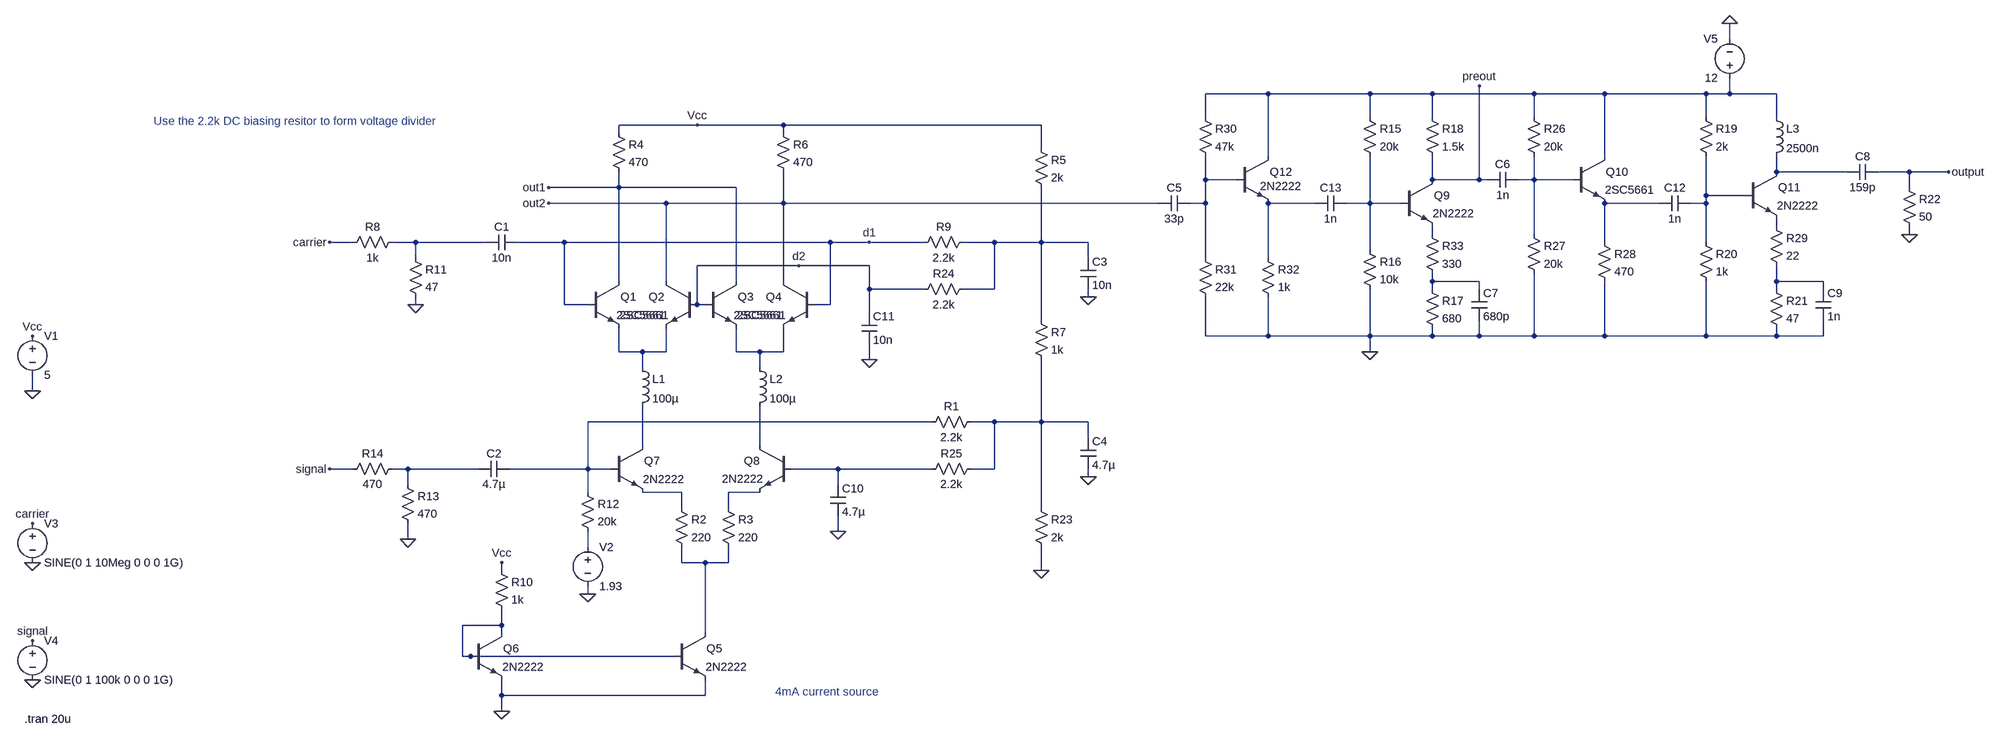
[diagram p0: schematic 100MHz_gilbert_cell.asc]
100MHz_gilbert_cell.asc, the LTspice schematic file:
Version 4
SHEET 1 2944 1096
WIRE 2400 -384 2400 -416
WIRE 1456 -272 1328 -272
WIRE 1664 -272 1456 -272
WIRE 1792 -272 1664 -272
WIRE 2000 -272 1792 -272
WIRE 2144 -272 2000 -272
WIRE 2352 -272 2144 -272
WIRE 2400 -272 2400 -304
WIRE 2400 -272 2352 -272
WIRE 2496 -272 2400 -272
WIRE 1328 -224 1328 -272
WIRE 1664 -224 1664 -272
WIRE 1792 -224 1792 -272
WIRE 2000 -224 2000 -272
WIRE 2352 -224 2352 -272
WIRE 2496 -224 2496 -272
WIRE 288 -208 128 -208
WIRE 464 -208 288 -208
WIRE 992 -208 464 -208
WIRE 128 -192 128 -208
WIRE 464 -192 464 -208
WIRE 992 -160 992 -208
WIRE 1456 -144 1456 -272
WIRE 2144 -144 2144 -272
WIRE 2496 -112 2496 -144
WIRE 2640 -112 2496 -112
WIRE 2768 -112 2704 -112
WIRE 2848 -112 2768 -112
WIRE 1328 -96 1328 -144
WIRE 1392 -96 1328 -96
WIRE 1792 -96 1792 -144
WIRE 1888 -96 1888 -288
WIRE 1888 -96 1792 -96
WIRE 1904 -96 1888 -96
WIRE 2000 -96 2000 -144
WIRE 2000 -96 1968 -96
WIRE 2080 -96 2000 -96
WIRE 128 -80 128 -112
WIRE 128 -80 -16 -80
WIRE 368 -80 128 -80
WIRE 2768 -80 2768 -112
WIRE 2352 -64 2352 -144
WIRE 2432 -64 2352 -64
WIRE 224 -48 -16 -48
WIRE 464 -48 464 -112
WIRE 464 -48 224 -48
WIRE 1232 -48 464 -48
WIRE 1328 -48 1328 -96
WIRE 1328 -48 1296 -48
WIRE 1552 -48 1456 -48
WIRE 1664 -48 1664 -144
WIRE 1664 -48 1616 -48
WIRE 1728 -48 1664 -48
WIRE 2256 -48 2144 -48
WIRE 2352 -48 2352 -64
WIRE 2352 -48 2320 -48
WIRE 2496 0 2496 -16
WIRE 1792 16 1792 0
WIRE 2000 16 2000 -96
WIRE 2768 16 2768 0
WIRE -416 32 -464 32
WIRE -288 32 -336 32
WIRE -144 32 -288 32
WIRE 16 32 -80 32
WIRE 560 32 16 32
WIRE 640 32 560 32
WIRE 752 32 640 32
WIRE 896 32 832 32
WIRE 992 32 992 -80
WIRE 992 32 896 32
WIRE 1088 32 992 32
WIRE 2144 32 2144 -48
WIRE 2352 32 2352 -48
WIRE 1664 48 1664 -48
WIRE -288 64 -288 32
WIRE 1088 64 1088 32
WIRE 1328 64 1328 -48
WIRE 1456 64 1456 -48
WIRE 496 80 288 80
WIRE 640 80 496 80
WIRE 128 112 128 -80
WIRE 224 112 224 -48
WIRE 368 112 368 -80
WIRE 464 112 464 -48
WIRE 1792 112 1792 96
WIRE 1888 112 1792 112
WIRE 2496 112 2496 80
WIRE 2592 112 2496 112
WIRE 640 128 640 80
WIRE 752 128 640 128
WIRE 896 128 896 32
WIRE 896 128 832 128
WIRE 1792 128 1792 112
WIRE 1888 128 1888 112
WIRE 2496 128 2496 112
WIRE 2592 128 2592 112
WIRE 1088 144 1088 128
WIRE -288 160 -288 144
WIRE 16 160 16 32
WIRE 64 160 16 160
WIRE 288 160 288 80
WIRE 304 160 288 160
WIRE 560 160 560 32
WIRE 560 160 528 160
WIRE 640 176 640 128
WIRE 992 192 992 32
WIRE 1328 224 1328 144
WIRE 1456 224 1456 144
WIRE 1456 224 1328 224
WIRE 1664 224 1664 128
WIRE 1664 224 1456 224
WIRE 1792 224 1792 208
WIRE 1792 224 1664 224
WIRE 1888 224 1888 192
WIRE 1888 224 1792 224
WIRE 2000 224 2000 96
WIRE 2000 224 1888 224
WIRE 2144 224 2144 112
WIRE 2144 224 2000 224
WIRE 2352 224 2352 112
WIRE 2352 224 2144 224
WIRE 2496 224 2496 208
WIRE 2496 224 2352 224
WIRE 2592 224 2592 192
WIRE 2592 224 2496 224
WIRE 128 256 128 208
WIRE 176 256 128 256
WIRE 224 256 224 208
WIRE 224 256 176 256
WIRE 368 256 368 208
WIRE 416 256 368 256
WIRE 464 256 464 208
WIRE 464 256 416 256
WIRE 1664 256 1664 224
WIRE 640 272 640 240
WIRE 176 288 176 256
WIRE 416 288 416 256
WIRE -1072 336 -1072 304
WIRE 768 400 64 400
WIRE 896 400 848 400
WIRE 992 400 992 272
WIRE 992 400 896 400
WIRE 1088 400 992 400
WIRE 1088 432 1088 400
WIRE 176 448 176 368
WIRE 416 448 416 368
WIRE -416 496 -464 496
WIRE -304 496 -336 496
WIRE -160 496 -304 496
WIRE 64 496 64 400
WIRE 64 496 -96 496
WIRE 112 496 64 496
WIRE 576 496 480 496
WIRE 768 496 576 496
WIRE 896 496 896 400
WIRE 896 496 848 496
WIRE 1088 512 1088 496
WIRE -304 528 -304 496
WIRE 576 528 576 496
WIRE 64 544 64 496
WIRE 256 544 176 544
WIRE 416 544 352 544
WIRE 256 576 256 544
WIRE 352 576 352 544
WIRE 992 576 992 400
WIRE 576 624 576 592
WIRE -304 640 -304 608
WIRE 64 656 64 624
WIRE 256 688 256 656
WIRE 304 688 256 688
WIRE 352 688 352 656
WIRE 352 688 304 688
WIRE -112 704 -112 688
WIRE 992 704 992 656
WIRE 64 752 64 736
WIRE -112 816 -112 784
WIRE -112 816 -192 816
WIRE -112 832 -112 816
WIRE 304 832 304 688
WIRE -192 880 -192 816
WIRE -176 880 -192 880
WIRE 240 880 -176 880
WIRE -112 960 -112 928
WIRE 304 960 304 928
WIRE 304 960 -112 960
WIRE -112 992 -112 960
FLAG 288 -208 Vcc
FLAG -1072 336 0
FLAG -1072 224 Vcc
FLAG -1072 688 0
FLAG -1072 928 0
FLAG -1072 608 carrier
FLAG -1072 848 signal
FLAG -464 496 signal
FLAG -464 32 carrier
FLAG -16 -80 out1
FLAG -16 -48 out2
FLAG -112 992 0
FLAG -112 688 Vcc
FLAG 640 32 d1
FLAG 496 80 d2
FLAG -288 160 0
FLAG 64 752 0
FLAG -304 640 0
FLAG 1664 256 0
FLAG 2848 -112 output
FLAG 2768 16 0
FLAG 1888 -288 preout
FLAG 992 704 0
FLAG 1088 512 0
FLAG 1088 144 0
FLAG 576 624 0
FLAG 640 272 0
FLAG 2400 -416 0
SYMBOL voltage -1072 208 R0
WINDOW 123 0 0 Left 0
WINDOW 39 0 0 Left 0
SYMATTR InstName V1
SYMATTR Value 5
SYMBOL voltage -1072 592 R0
WINDOW 123 0 0 Left 0
WINDOW 39 0 0 Left 0
SYMATTR InstName V3
SYMATTR Value SINE(0 1 10Meg 0 0 0 1G)
SYMBOL voltage -1072 832 R0
WINDOW 123 0 0 Left 0
WINDOW 39 0 0 Left 0
SYMATTR InstName V4
SYMATTR Value SINE(0 1 100k 0 0 0 1G)
SYMBOL npn 112 448 R0
WINDOW 0 67 32 Left 2
WINDOW 3 65 69 Left 2
SYMATTR InstName Q7
SYMATTR Value 2N2222
SYMBOL npn 480 448 M0
WINDOW 0 64 32 Left 2
WINDOW 3 57 68 Left 2
SYMATTR InstName Q8
SYMATTR Value 2N2222
SYMBOL res 848 16 R90
WINDOW 0 0 56 VBottom 2
WINDOW 3 32 56 VTop 2
SYMATTR InstName R9
SYMATTR Value 2.2k
SYMBOL cap -80 16 R90
WINDOW 0 0 32 VBottom 2
WINDOW 3 32 32 VTop 2
SYMATTR InstName C1
SYMATTR Value 10n
SYMBOL cap -96 480 R90
WINDOW 0 0 32 VBottom 2
WINDOW 3 32 32 VTop 2
SYMATTR InstName C2
SYMATTR Value 4.7µ
SYMBOL res 864 384 R90
WINDOW 0 0 56 VBottom 2
WINDOW 3 32 56 VTop 2
SYMATTR InstName R1
SYMATTR Value 2.2k
SYMBOL res 112 -208 R0
SYMATTR InstName R4
SYMATTR Value 470
SYMBOL res 448 -208 R0
SYMATTR InstName R6
SYMATTR Value 470
SYMBOL npn 64 112 R0
WINDOW 0 67 32 Left 2
WINDOW 3 65 69 Left 2
SYMATTR InstName Q1
SYMATTR Value 2SC5661
SYMBOL npn 288 112 M0
WINDOW 0 67 32 Left 2
WINDOW 3 65 69 Left 2
SYMATTR InstName Q2
SYMATTR Value 2SC5661
SYMBOL npn 304 112 R0
WINDOW 0 67 32 Left 2
WINDOW 3 65 69 Left 2
SYMATTR InstName Q3
SYMATTR Value 2SC5661
SYMBOL npn 528 112 M0
WINDOW 0 67 32 Left 2
WINDOW 3 65 69 Left 2
SYMATTR InstName Q4
SYMATTR Value 2SC5661
SYMBOL npn 240 832 R0
WINDOW 0 67 32 Left 2
WINDOW 3 65 69 Left 2
SYMATTR InstName Q5
SYMATTR Value 2N2222
SYMBOL npn -176 832 R0
WINDOW 0 67 32 Left 2
WINDOW 3 65 69 Left 2
SYMATTR InstName Q6
SYMATTR Value 2N2222
SYMBOL res -128 688 R0
SYMATTR InstName R10
SYMATTR Value 1k
SYMBOL res 240 560 R0
SYMATTR InstName R2
SYMATTR Value 220
SYMBOL res 336 560 R0
SYMATTR InstName R3
SYMATTR Value 220
SYMBOL res -320 16 R90
WINDOW 0 0 56 VBottom 2
WINDOW 3 32 56 VTop 2
SYMATTR InstName R8
SYMATTR Value 1k
SYMBOL res -304 48 R0
SYMATTR InstName R11
SYMATTR Value 47
SYMBOL ind 160 272 R0
SYMATTR InstName L1
SYMATTR Value 100µ
SYMBOL ind 400 272 R0
SYMATTR InstName L2
SYMATTR Value 100µ
SYMBOL res 48 528 R0
SYMATTR InstName R12
SYMATTR Value 20k
SYMBOL voltage 64 640 R0
WINDOW 123 0 0 Left 0
WINDOW 39 0 0 Left 0
SYMATTR InstName V2
SYMATTR Value 1.93
SYMBOL res -320 480 R90
WINDOW 0 0 56 VBottom 2
WINDOW 3 32 56 VTop 2
SYMATTR InstName R14
SYMATTR Value 470
SYMBOL res -320 512 R0
SYMATTR InstName R13
SYMATTR Value 470
SYMBOL cap 1296 -64 R90
WINDOW 0 0 32 VBottom 2
WINDOW 3 32 32 VTop 2
SYMATTR InstName C5
SYMATTR Value 33p
SYMBOL res 1648 -240 R0
SYMATTR InstName R15
SYMATTR Value 20k
SYMBOL res 1648 32 R0
SYMATTR InstName R16
SYMATTR Value 10k
SYMBOL res 1776 112 R0
SYMATTR InstName R17
SYMATTR Value 680
SYMBOL res 1776 -240 R0
SYMATTR InstName R18
SYMATTR Value 1.5k
SYMBOL cap 1968 -112 R90
WINDOW 0 0 32 VBottom 2
WINDOW 3 32 32 VTop 2
SYMATTR InstName C6
SYMATTR Value 1n
SYMBOL res 2336 -240 R0
SYMATTR InstName R19
SYMATTR Value 2k
SYMBOL res 2336 16 R0
SYMATTR InstName R20
SYMATTR Value 1k
SYMBOL res 2480 112 R0
SYMATTR InstName R21
SYMATTR Value 47
SYMBOL ind 2480 -240 R0
SYMATTR InstName L3
SYMATTR Value 2500n
SYMBOL cap 2704 -128 R90
WINDOW 0 0 32 VBottom 2
WINDOW 3 32 32 VTop 2
SYMATTR InstName C8
SYMATTR Value 159p
SYMBOL res 2752 -96 R0
SYMATTR InstName R22
SYMATTR Value 50
SYMBOL npn 2432 -112 R0
WINDOW 0 67 32 Left 2
WINDOW 3 65 69 Left 2
SYMATTR InstName Q11
SYMATTR Value 2N2222
SYMBOL res 976 -176 R0
SYMATTR InstName R5
SYMATTR Value 2k
SYMBOL res 976 176 R0
SYMATTR InstName R7
SYMATTR Value 1k
SYMBOL res 976 560 R0
SYMATTR InstName R23
SYMATTR Value 2k
SYMBOL cap 1072 64 R0
SYMATTR InstName C3
SYMATTR Value 10n
SYMBOL cap 1072 432 R0
SYMATTR InstName C4
SYMATTR Value 4.7µ
SYMBOL res 848 112 R90
WINDOW 0 0 56 VBottom 2
WINDOW 3 32 56 VTop 2
SYMATTR InstName R24
SYMATTR Value 2.2k
SYMBOL res 864 480 R90
WINDOW 0 0 56 VBottom 2
WINDOW 3 32 56 VTop 2
SYMATTR InstName R25
SYMATTR Value 2.2k
SYMBOL cap 560 528 R0
SYMATTR InstName C10
SYMATTR Value 4.7µ
SYMBOL cap 624 176 R0
SYMATTR InstName C11
SYMATTR Value 10n
SYMBOL res 1984 -240 R0
SYMATTR InstName R26
SYMATTR Value 20k
SYMBOL res 1984 0 R0
SYMATTR InstName R27
SYMATTR Value 20k
SYMBOL npn 2080 -144 R0
WINDOW 0 67 32 Left 2
WINDOW 3 65 69 Left 2
SYMATTR InstName Q10
SYMATTR Value 2SC5661
SYMBOL res 2128 16 R0
SYMATTR InstName R28
SYMATTR Value 470
SYMBOL cap 2320 -64 R90
WINDOW 0 0 32 VBottom 2
WINDOW 3 32 32 VTop 2
SYMATTR InstName C12
SYMATTR Value 1n
SYMBOL cap 1872 128 R0
SYMATTR InstName C7
SYMATTR Value 680p
SYMBOL cap 2576 128 R0
SYMATTR InstName C9
SYMATTR Value 1n
SYMBOL res 2480 -16 R0
SYMATTR InstName R29
SYMATTR Value 22
SYMBOL voltage 2400 -288 R180
WINDOW 0 24 96 Left 2
WINDOW 3 24 16 Left 2
WINDOW 123 0 0 Left 0
WINDOW 39 0 0 Left 0
SYMATTR InstName V5
SYMATTR Value 12
SYMBOL npn 1728 -96 R0
WINDOW 0 67 32 Left 2
WINDOW 3 65 69 Left 2
SYMATTR InstName Q9
SYMATTR Value 2N2222
SYMBOL res 1312 -240 R0
SYMATTR InstName R30
SYMATTR Value 47k
SYMBOL res 1312 48 R0
SYMATTR InstName R31
SYMATTR Value 22k
SYMBOL res 1440 48 R0
SYMATTR InstName R32
SYMATTR Value 1k
SYMBOL npn 1392 -144 R0
WINDOW 0 67 32 Left 2
WINDOW 3 47 61 Left 2
SYMATTR InstName Q12
SYMATTR Value 2N2222
SYMBOL cap 1616 -64 R90
WINDOW 0 0 32 VBottom 2
WINDOW 3 32 32 VTop 2
SYMATTR InstName C13
SYMATTR Value 1n
SYMBOL res 1776 0 R0
SYMATTR InstName R33
SYMATTR Value 330
TEXT -1088 1008 Left 2 !.tran 20u
TEXT -824 -216 Left 2 ;Use the 2.2k DC biasing resitor to form voltage divider
TEXT 448 952 Left 2 ;4mA current source

The netlist it stands for:
* 100MHz_gilbert_cell.asc
V1 Vcc 0 5
V3 carrier 0 SINE(0 1 10Meg 0 0 0 1G)
V4 signal 0 SINE(0 1 100k 0 0 0 1G)
Q7 N019 N017 N023 0 2N2222
Q8 N020 N022 N024 0 2N2222
R9 N012 d1 2.2k
C1 d1 N011 10n
C2 N017 N021 4.7µ
R1 N018 N017 2.2k
R4 Vcc out1 470
R6 Vcc out2 470
Q1 out1 d1 N015 0 2SC5661
Q2 out2 d2 N015 0 2SC5661
Q3 out1 d2 N016 0 2SC5661
Q4 out2 d1 N016 0 2SC5661
Q5 N026 N027 0 0 2N2222
Q6 N027 N027 0 0 2N2222
R10 Vcc N027 1k
R2 N023 N026 220
R3 N024 N026 220
R8 N011 carrier 1k
R11 N011 0 47
L1 N015 N019 100µ
L2 N016 N020 100µ
R12 N017 N025 20k
V2 N025 0 1.93
R14 N021 signal 470
R13 N021 0 470
C5 N003 out2 33p
R15 N001 N007 20k
R16 N007 0 10k
R17 N013 0 680
R18 N001 preout 1.5k
C6 N004 preout 1n
R19 N001 N005 2k
R20 N005 0 1k
R21 N014 0 47
L3 N001 N002 2500n
C8 output N002 159p
R22 output 0 50
Q11 N002 N005 N009 0 2N2222
R5 Vcc N012 2k
R7 N012 N018 1k
R23 N018 0 2k
C3 N012 0 10n
C4 N018 0 4.7µ
R24 N012 d2 2.2k
R25 N018 N022 2.2k
C10 N022 0 4.7µ
C11 d2 0 10n
R26 N001 N004 20k
R27 N004 0 20k
Q10 N001 N004 N008 0 2SC5661
R28 N008 0 470
C12 N005 N008 1n
C7 N013 0 680p
C9 N014 0 1n
R29 N009 N014 22
V5 N001 0 12
Q9 preout N007 N010 0 2N2222
R30 N001 N003 47k
R31 N003 0 22k
R32 N006 0 1k
Q12 N001 N003 N006 0 2N2222
C13 N007 N006 1n
R33 N010 N013 330
.model NPN NPN
.model PNP PNP
.lib standard.bjt
.tran 20u
* Use the 2.2k DC biasing resitor to form voltage divider
* 4mA current source
.backanno
.end